# Altium schematic sheet Braking.SchDoc
size A4; SheetNumber: 5; SheetTotal: 5
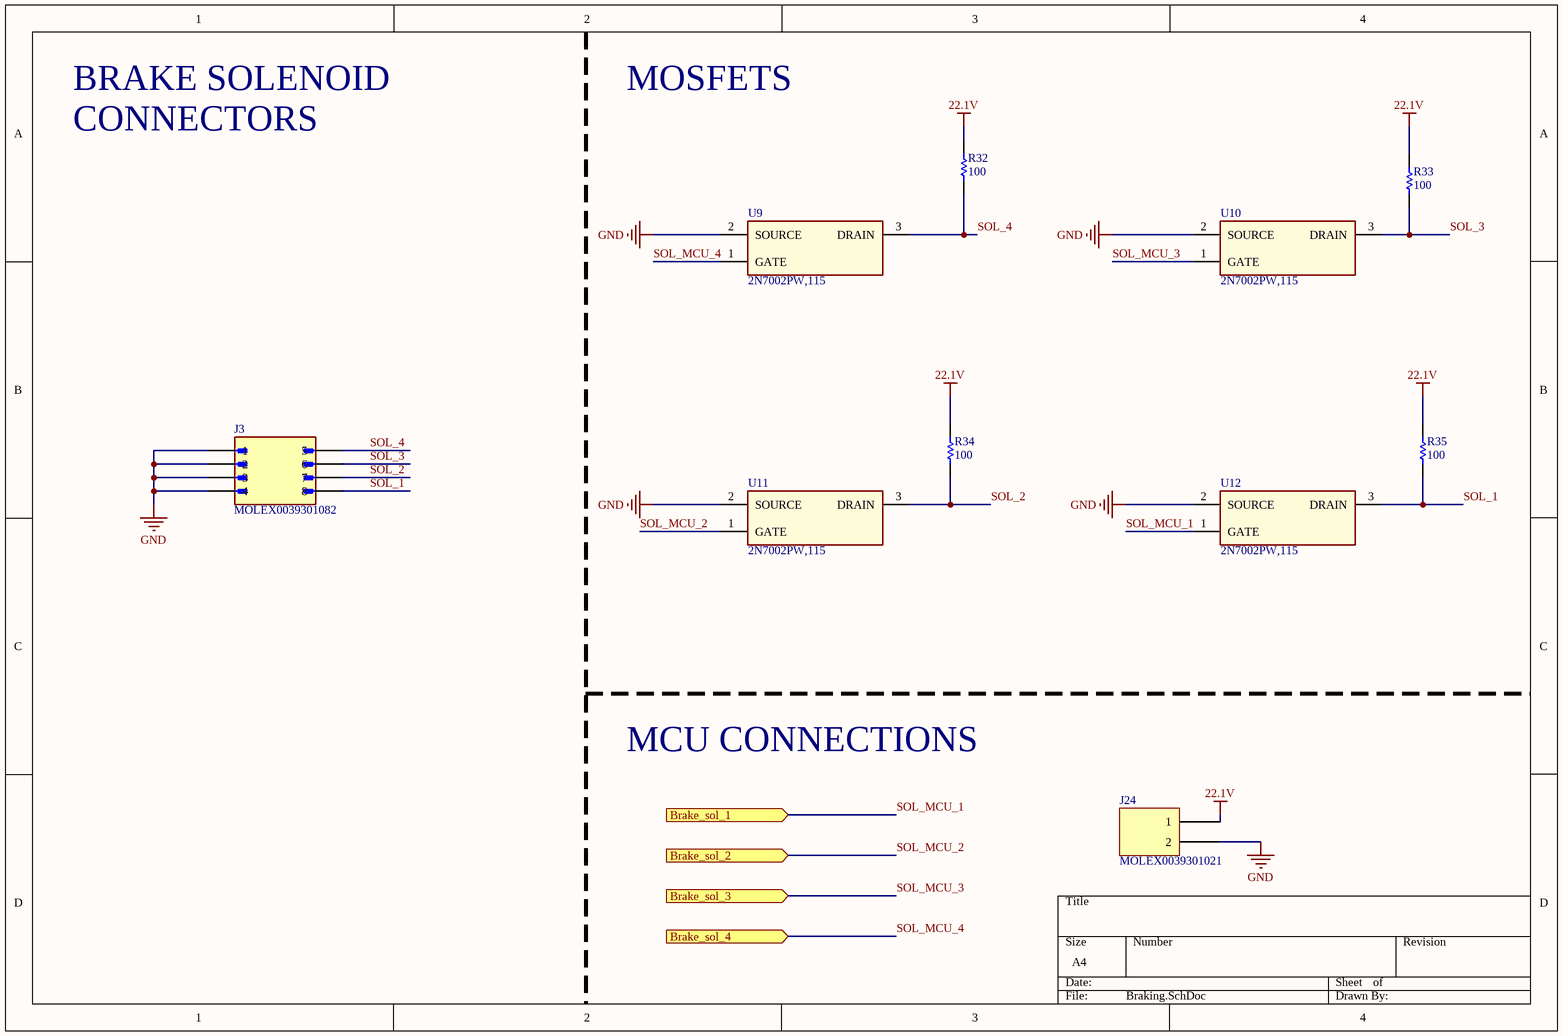
[diagram p0: Braking.SchDoc]

## Parts
J3  MOLEX0039301082  [MOLEX0039301082]
J24  MOLEX0039301021  [MOLEX0039301021]
R32  value 100  [0805 - Resistor]  (hidden comment: Resistor)
R33  value 100  [0805 - Resistor]  (hidden comment: Resistor)
R34  value 100  [0805 - Resistor]  (hidden comment: Resistor)
R35  value 100  [0805 - Resistor]  (hidden comment: Resistor)
U9  2N7002PW,115  [SOT65P210X110-3N]
U10  2N7002PW,115  [SOT65P210X110-3N]
U11  2N7002PW,115  [SOT65P210X110-3N]
U12  2N7002PW,115  [SOT65P210X110-3N]

## Ports
Brake_sol_1 (in), Brake_sol_2 (in), Brake_sol_3 (in), Brake_sol_4 (in)

## Nets
22.1V: J24.1 R32.2 R33.2 R34.2 R35.2
GND: J3.1 J3.2 J3.3 J3.4 J24.2 U9.2(SOURCE) U10.2(SOURCE) U11.2(SOURCE) U12.2(SOURCE)
SOL_1: J3.8 R35.1 U12.3(DRAIN)
SOL_2: J3.7 R34.1 U11.3(DRAIN)
SOL_3: J3.6 R33.1 U10.3(DRAIN)
SOL_4: J3.5 R32.1 U9.3(DRAIN)
SOL_MCU_1: U12.1(GATE) ; port Brake_sol_1
SOL_MCU_2: U11.1(GATE) ; port Brake_sol_2
SOL_MCU_3: U10.1(GATE) ; port Brake_sol_3
SOL_MCU_4: U9.1(GATE) ; port Brake_sol_4

## Notes on the sheet
- BRAKE SOLENOID
- MOSFETS
- CONNECTORS
- MCU CONNECTIONS

## Library data of the parts
J3 = MOLEX0039301082: Connector Header Through Hole, Right Angle 8 position 0.165" (4.20mm); Manufacturer: Molex; Manufacturer Part Number: 0039301082; Supplier: DigiKey; Supplier Part Number: WM21366-ND; ComponentLink1Description: Datasheet; ComponentLink1URL: https://www.molex.com/pdm_docs/sd/039301082_sd.pdf
J24 = MOLEX0039301021: Connector Header Through Hole, Right Angle 2 pin 0.165" (4.20mm)
U9-U12 = 2N7002PW,115: N-Channel 60V 310mA (Ta) 260mW (Ta) Surface Mount SOT-323; MF: Nexperia USA; SnapEDA_Link: https://www.snapeda.com/parts/2N7002PW,115/Nexperia%20USA%20Inc./view-part/2152859/?ref=snap; MP: 2N7002PW,115; Value: *; Digi-Key_Part_Number: 1727-4793-1-ND; Package: SOT-323 Nexperia; ComponentLink1Description: Manufacturer name; ComponentLink1URL: *Nexperia USA Inc.; ComponentLink2Description: Manufacturer part number; ComponentLink2URL: PMF370XN,115; ComponentLink3Description: Supplier name; ComponentLink3URL: Digikey; ComponentLink4Description: Supplier part #; ComponentLink4URL: 1727-5422-2-ND
R32-R35 = Resistor: Rating: *; Manufacturer Part Number: *; Manufacturer: *; Supplier Part Number: *; Supplier: *